# Altium schematic sheet Э3-3 Внешний триггер.SchDoc
size 594 x 420 mm; Address1: Address1; Address2: Address2; Address3: Address3; Address4: Address4; DocumentNumber: АБВГ.123456.001 Э3; SheetNumber: 4; SheetTotal: 7; Scale: 1:1; DocumentType: Схема электрическая принципиальная; FirstReferrence: АБВГ.123456.001
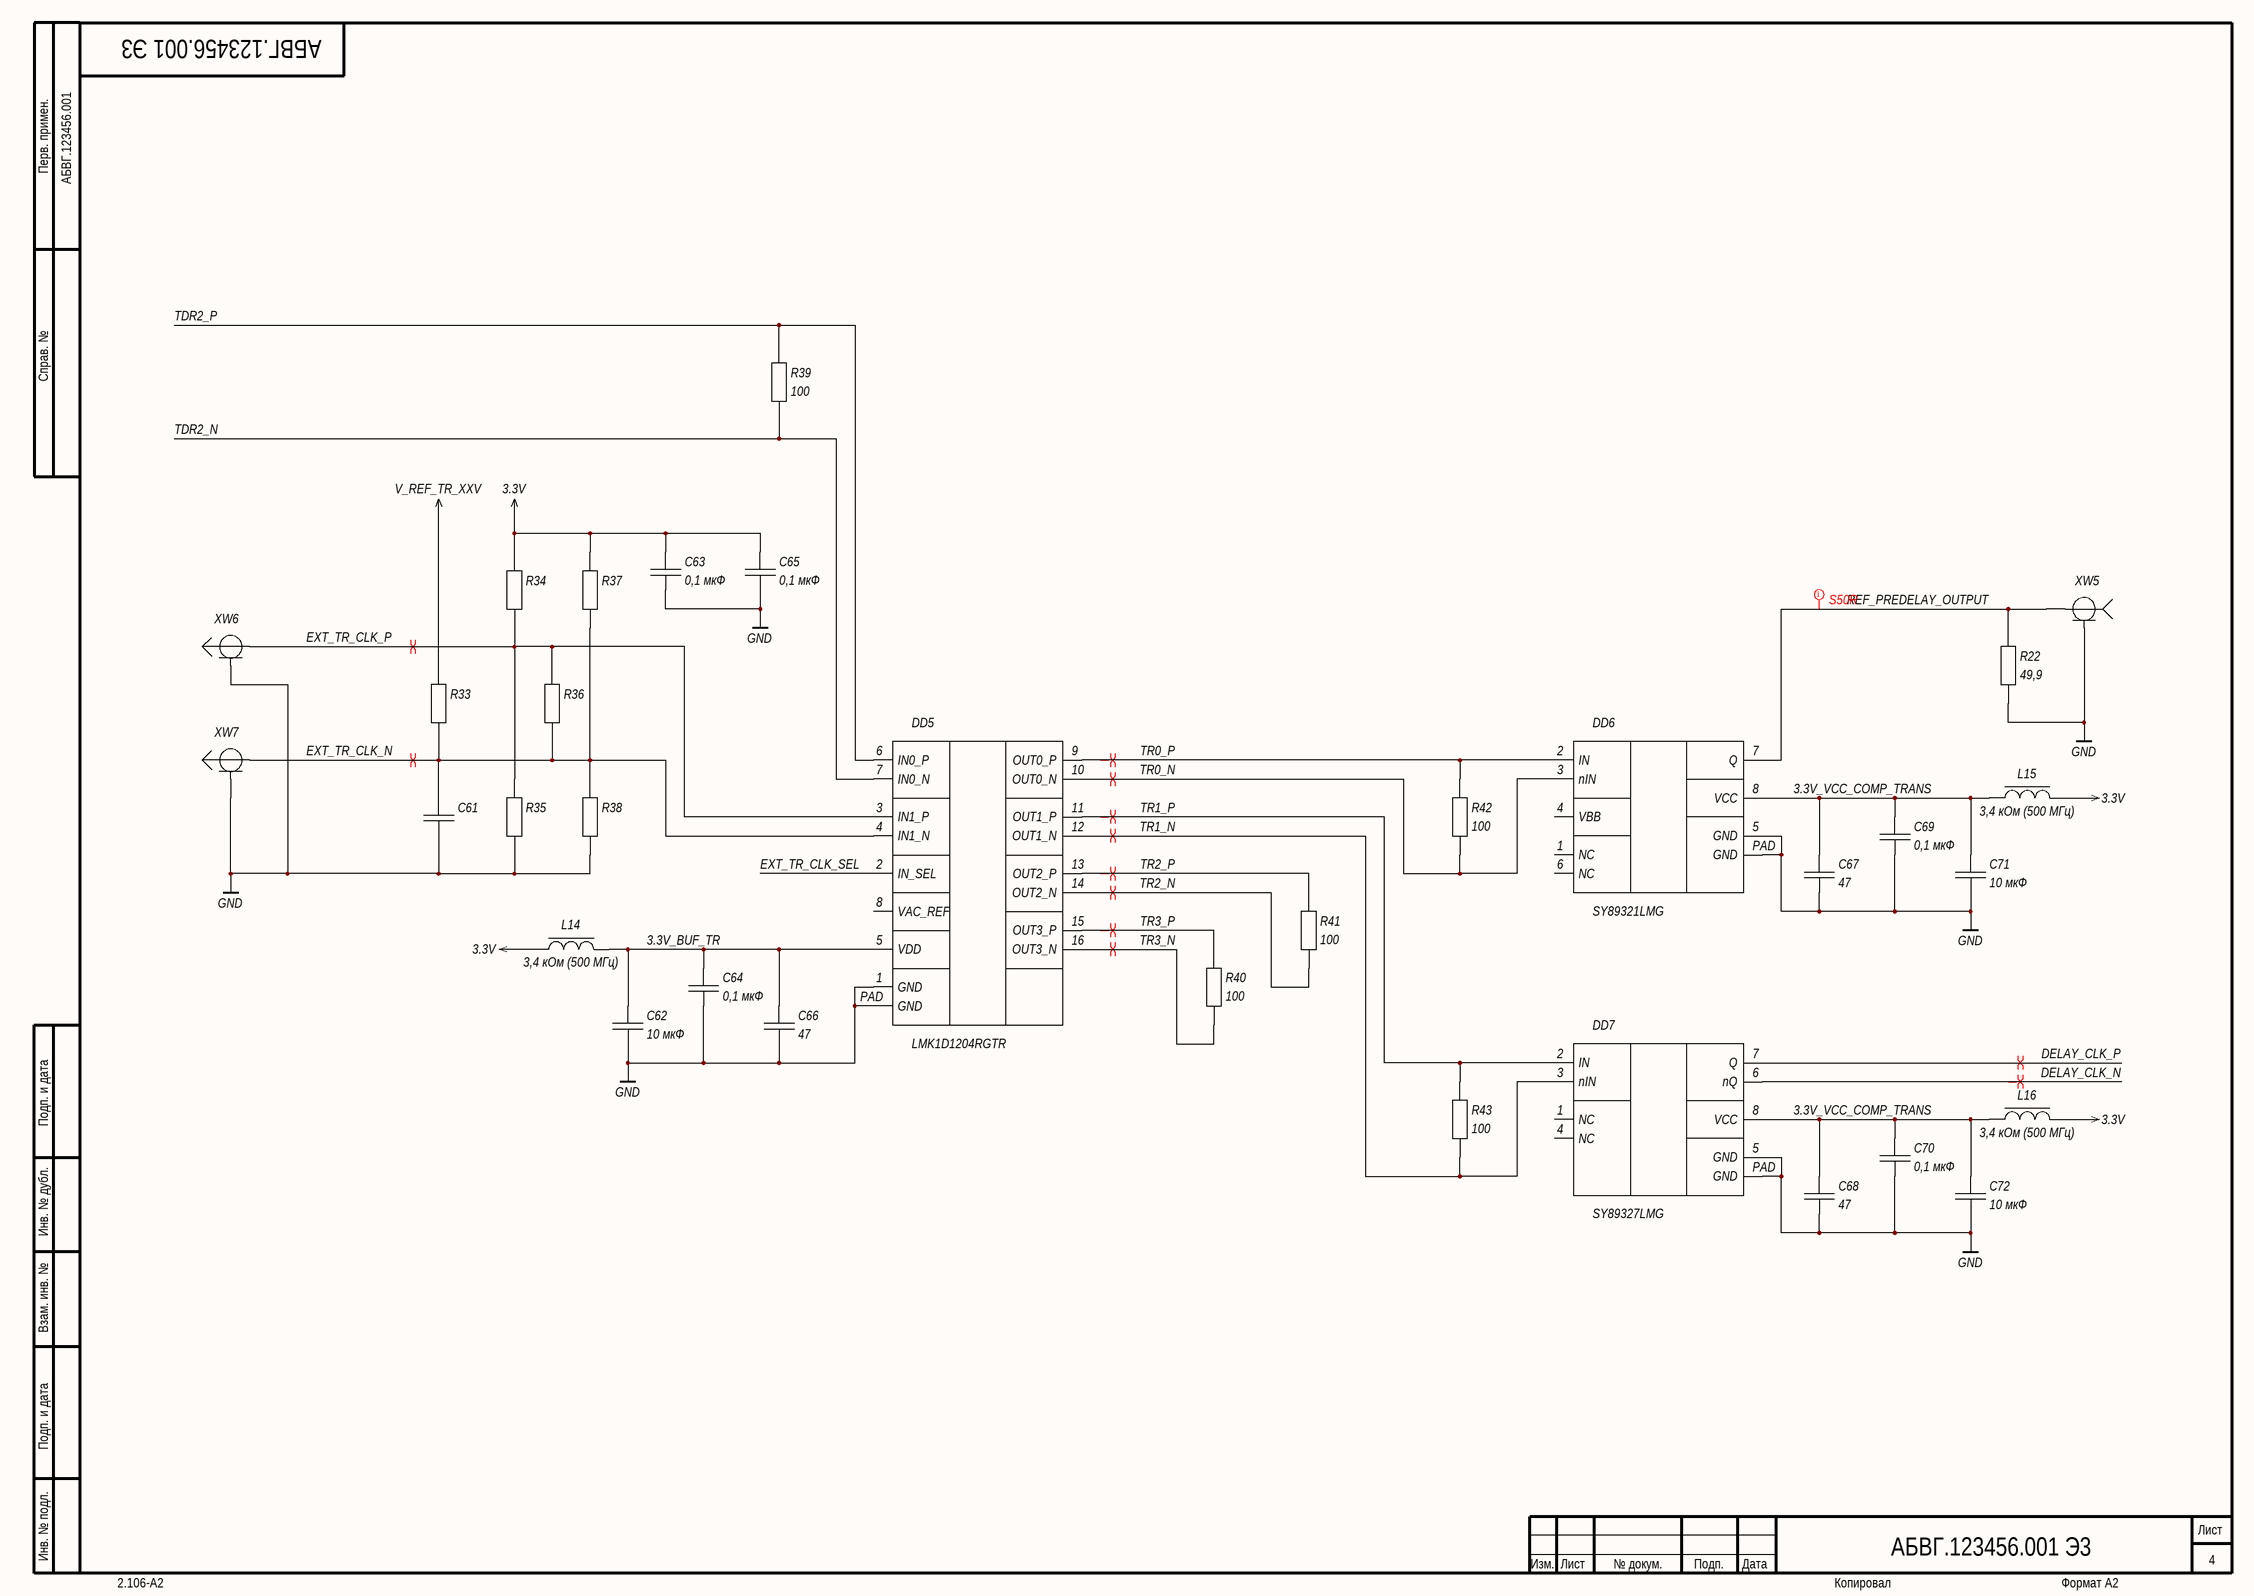
[diagram p0: Э3-3 Внешний триггер.SchDoc]

## Parts
C61  (no value)  [C0402-B-0.5mm]
C62  value 10 мкФ  [C0603-B-0.8mm]
C63  value 0,1 мкФ  [C0402-B-0.5mm]
C64  value 0,1 мкФ  [C0402-B-0.5mm]
C65  value 0,1 мкФ  [C0402-B-0.5mm]
C66  value 47  [C0402-B-0.5mm]
C67  value 47  [C0402-B-0.5mm]
C68  value 47  [C0402-B-0.5mm]
C69  value 0,1 мкФ  [C0402-B-0.5mm]
C70  value 0,1 мкФ  [C0402-B-0.5mm]
C71  value 10 мкФ  [C0603-B-0.8mm]
C72  value 10 мкФ  [C0603-B-0.8mm]
DD5  LMK1D1204RGTR  [16-QFN-3-H1-EP1.7]
DD6  SY89321LMG  [8-MLF]
DD7  SY89327LMG  [8-MLF]
L14  value 3,4 кОм (500 МГц)  [L0402-B-0.5mm]
L15  value 3,4 кОм (500 МГц)  [L0402-B-0.5mm]
L16  value 3,4 кОм (500 МГц)  [L0402-B-0.5mm]
R22  value 49,9  [CR0402-B-0.35mm]
R33  (no value)  [CR0402-B-0.35mm]
R34  (no value)  [CR0402-B-0.35mm]
R35  (no value)  [CR0402-B-0.35mm]
R36  (no value)  [CR0402-B-0.35mm]
R37  (no value)  [CR0402-B-0.35mm]
R38  (no value)  [CR0402-B-0.35mm]
R39  value 100  [CR0402-B-0.35mm]
R40  value 100  [CR0402-B-0.35mm]
R41  value 100  [CR0402-B-0.35mm]
R42  value 100  [CR0402-B-0.35mm]
R43  value 100  [CR0402-B-0.35mm]
XW5  XW(S)  [SMA-J-P-H-ST-EM1]  (value not drawn)
XW6  XW(P)  [U.FL STR PLG]  (value not drawn)
XW7  XW(P)  [U.FL STR PLG]  (value not drawn)

## Nets
3.3V: C63.1 C65.1 L14.1 L15.2 L16.2 R34.1 R37.1
GND: C61.2 C62.2 C63.2 C64.2 C65.2 C66.2 C67.2 C68.2 C69.2 C70.2 C71.2 C72.2 DD5.1(GND) DD5.PAD(GND) DD6.5(GND) DD6.PAD(GND) DD7.5(GND) DD7.PAD(GND) R22.2 R35.2 R38.2 XW5.2 XW6.2 XW7.2
V_REF_TR_XXV: R33.1
3.3V_BUF_TR: C62.1 C64.1 C66.1 DD5.5(VDD) L14.2
3.3V_VCC_COMP_TRANS: C67.1 C68.1 C69.1 C70.1 C71.1 C72.1 DD6.8(VCC) DD7.8(VCC) L15.1 L16.1
DELAY_CLK_N: DD7.6(nQ)
DELAY_CLK_P: DD7.7(Q)
EXT_TR_CLK_N: C61.1 DD5.4(IN1_N) R33.2 R36.2 R37.2 R38.1 XW7.1
EXT_TR_CLK_P: DD5.3(IN1_P) R34.2 R35.1 R36.1 XW6.1
EXT_TR_CLK_SEL: DD5.2(IN_SEL)
REF_PREDELAY_OUTPUT: DD6.7(Q) R22.1 XW5.1
TDR2_N: DD5.7(IN0_N) R39.2
TDR2_P: DD5.6(IN0_P) R39.1
TR0_N: DD5.10(OUT0_N) DD6.3(nIN) R42.2
TR0_P: DD5.9(OUT0_P) DD6.2(IN) R42.1
TR1_N: DD5.12(OUT1_N) DD7.3(nIN) R43.2
TR1_P: DD5.11(OUT1_P) DD7.2(IN) R43.1
TR2_N: DD5.14(OUT2_N) R41.2
TR2_P: DD5.13(OUT2_P) R41.1
TR3_N: DD5.16(OUT3_N) R40.2
TR3_P: DD5.15(OUT3_P) R40.1

Not connected (* = marked no-connect by the designer): DD5 8(VAC_REF); DD6 1(NC) 4(VBB) 6(NC); DD7 1(NC) 4(NC)

## Layout directives
differential pair: DELAY_CLK_N, DELAY_CLK_P, EXT_TR_CLK_N, EXT_TR_CLK_P, TR0_N, TR0_P, TR1_N, TR1_P, TR2_N, TR2_P, TR3_N, TR3_P
net class S50R: REF_PREDELAY_OUTPUT

## Notes on the sheet
- Перв. примен.
- Справ. №
- Подп. и дата
- Инв. № дубл.
- Взам. инв. №
- Инв. № подл.
- Изм.
- Лист
- № докум.
- Подп.
- Дата
- 2.106-A2
- Копировал
- Формат А2

## Library data of the parts
C61 = Non Polar Ver.: PartNumber: GRM155R71H104KE14D; TemperatureRange: -XX...+XX°C; VoltageRating: 50 В; Manufacturer: *; Package: *; HelpURL: *; Tolerance: *; TypeDielectric: *; ESR: *; ComponentType: CAP
C62 C71 C72 = Non Polar Ver.: 0603 X5R 10 мкФ ±20 % 25 В; PartNumber: GRM188R61E106MA73; TemperatureRange: -XX...+XX°C; VoltageRating: 25 В; Manufacturer: *; Package: *; HelpURL: *; Tolerance: *; TypeDielectric: *; ESR: *; ComponentType: CAP
C63-C65 C69 C70 = Non Polar Ver.: 0402 X7R 0,1 мкФ ±10 % 50 В; PartNumber: GRM155R71H104KE14D; TemperatureRange: -XX...+XX°C; VoltageRating: 50 В; Manufacturer: *; Package: *; HelpURL: *; Tolerance: *; TypeDielectric: *; ESR: *; ComponentType: CAP
C66-C68 = Non Polar Ver.: 0402 NP0 47 пФ ±5 % 50 В; PartNumber: GCM1555C1H470JA16; TemperatureRange: -XX...+XX°C; VoltageRating: 50 В; Manufacturer: *; Package: *; HelpURL: *; Tolerance: *; TypeDielectric: *; ESR: *; ComponentType: CAP
DD5 = LMK1D1204: Low Additive Jitter LVDS Buffer; Manufacturer: Texas Instruments, Inc.; TemperatureRange: -40...+85°C; Package: 16-VQFN; PartNumber: LMK1D1204RGTR; ComponentType: IC; DatasheetURL: *; HelpURL: *; PinCount: 16
DD6 = SY89321L: 3.3V DIFFERENTIAL LVPECL/CML/LVDS-to-LVTTL TRANSLATOR; Manufacturer: Microchip Technology; TemperatureRange: -40...+85°C; Package: 8-MLF; PartNumber: SY89321LMG; ComponentType: IC; DatasheetURL: *; HelpURL: *; PinCount: 8
DD7 = SY89327L: 3.3V 2.5Gbps ANY INPUT-to-LVPECL DIFFERENTIAL TRANSLATOR; Manufacturer: Microchip Technology; TemperatureRange: -40...+85°C; Package: 8-QFN; PartNumber: SY89327LMG; ComponentType: IC; DatasheetURL: *; HelpURL: *; PinCount: 8
L14-L16 = Inductor MC Hor.: PartNumber: BLM15HD182BH1; TemperatureRange: -XX...+XX°C; Manufacturer: *; Package: *; HelpURL: *; MaxCurrent: *; ComponentType: IND; DatasheetURL: *; PinCount: 2
R22 = Resistor Ver.: 0402 49,9 Ом ±1 %; TemperatureRange: -XX...+XX°C; Manufacturer: *; PartNumber: *; Package: *; HelpURL: *; PowerRating: *; DatasheetURL: *; Tolerance: *; ComponentType: RES
R33-R38 = Resistor Ver.: TemperatureRange: -XX...+XX°C; Manufacturer: *; PartNumber: *; Package: *; HelpURL: *; PowerRating: *; DatasheetURL: *; Tolerance: *; ComponentType: RES
R39-R43 = Resistor Ver.: 0402 100 Ом ±1 %; TemperatureRange: -XX...+XX°C; Manufacturer: *; PartNumber: *; Package: *; HelpURL: *; PowerRating: *; DatasheetURL: *; Tolerance: *; ComponentType: RES
XW5 = XW(S): TemperatureRange: -XX...+XX°C; Manufacturer: *; Package: *; HelpURL: *; DatasheetURL: *; PartNumber: *; PinCount: 2; ComponentType: Connector
XW6 XW7 = XW(P): TemperatureRange: -XX...+XX°C; Manufacturer: *; Package: *; HelpURL: *; DatasheetURL: *; PartNumber: *; PinCount: 2; ComponentType: Connector